# Altium schematic sheet T-FLASH.SchDoc: Air724UG 参考设计
size 594 x 419 mm; DESIGNER: Loukanghua; REV: V1.0
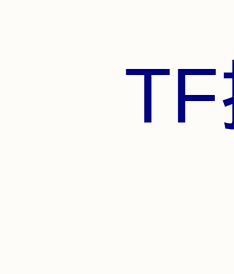
[diagram p0: T-FLASH.SchDoc, top left]
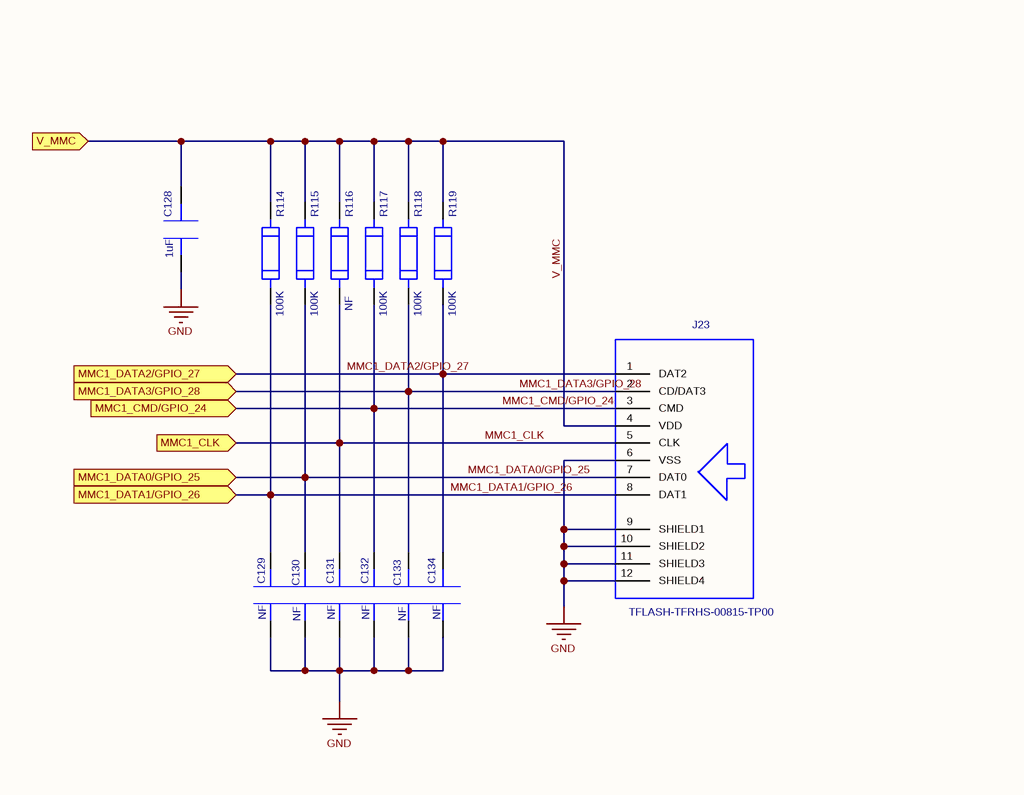
[diagram p1: T-FLASH.SchDoc, top middle]
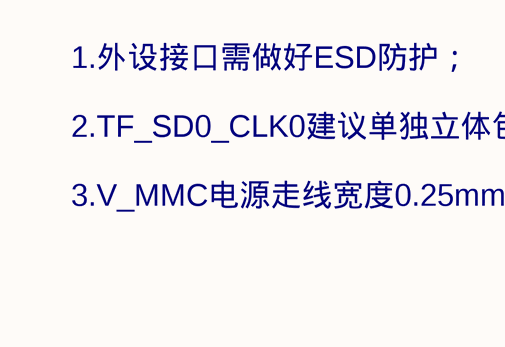
[diagram p2: T-FLASH.SchDoc, bottom middle]
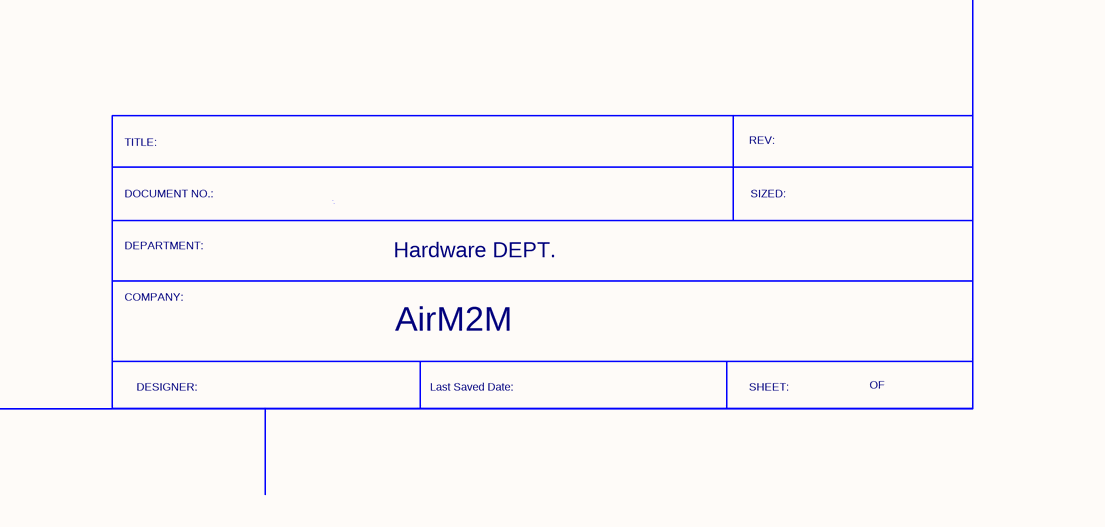
[diagram p3: T-FLASH.SchDoc, bottom right]

## Parts
C128  value 1uF  [SC0402]  (hidden comment: CAP-1UF-0402-X5R)
C129  value NF  [SC0402-NF]  (hidden comment: CAP-0402-NF)
C130  value NF  [SC0402-NF]  (hidden comment: CAP-0402-NF)
C131  value NF  [SC0402-NF]  (hidden comment: CAP-0402-NF)
C132  value NF  [SC0402-NF]  (hidden comment: CAP-0402-NF)
C133  value NF  [SC0402-NF]  (hidden comment: CAP-0402-NF)
C134  value NF  [SC0402-NF]  (hidden comment: CAP-0402-NF)
J23  TFLASH-TFRHS-00815-TP00  [TFLASH-TFRHS-00815-TP00]
R114  value 100K  [SR0402]  (hidden comment: RES-100K-0402)
R115  value 100K  [SR0402]  (hidden comment: RES-100K-0402)
R116  value NF  [SR0402-NF]  (hidden comment: RES-0402-NF)
R117  value 100K  [SR0402]  (hidden comment: RES-100K-0402)
R118  value 100K  [SR0402]  (hidden comment: RES-100K-0402)
R119  value 100K  [SR0402]  (hidden comment: RES-100K-0402)

## Ports
MMC1_CLK, MMC1_CMD/GPIO_24, MMC1_DATA0/GPIO_25, MMC1_DATA1/GPIO_26, MMC1_DATA2/GPIO_27, MMC1_DATA3/GPIO_28, V_MMC

## Nets
GND: C128.2 C129.2 C130.2 C131.2 C132.2 C133.2 C134.2 J23.6(VSS) J23.9(SHIELD1) J23.10(SHIELD2) J23.11(SHIELD3) J23.12(SHIELD4)
MMC1_CLK: C131.1 J23.5(CLK) R116.1 ; port MMC1_CLK
MMC1_CMD/GPIO_24: C132.1 J23.3(CMD) R117.1 ; port MMC1_CMD/GPIO_24
MMC1_DATA0/GPIO_25: C130.1 J23.7(DAT0) R115.1 ; port MMC1_DATA0/GPIO_25
MMC1_DATA1/GPIO_26: C129.1 J23.8(DAT1) R114.1 ; port MMC1_DATA1/GPIO_26
MMC1_DATA2/GPIO_27: C134.1 J23.1(DAT2) R119.1 ; port MMC1_DATA2/GPIO_27
MMC1_DATA3/GPIO_28: C133.1 J23.2(CD/DAT3) R118.1 ; port MMC1_DATA3/GPIO_28
V_MMC: C128.1 J23.4(VDD) R114.2 R115.2 R116.2 R117.2 R118.2 R119.2 ; port V_MMC

## Notes on the sheet
- TF接口参考电路
- 1.外设接口需做好ESD防护；
- 2.TF_SD0_CLK0建议单独立体包地，其他信号线整组一起同层包地；
- 3.V_MMC电源走线宽度0.25mm以上。
- TITLE:
- REV:
- DEPARTMENT:
- DOCUMENT NO.:
- Hardware DEPT.
- SIZED:
- COMPANY:
- AirM2M
- DESIGNER:
- Last Saved Date:
- SHEET:
- OF

## Library data of the parts
C128 = CAP-1UF-0402-X5R: CAP CER X5R;1uF;+/-10%;6.3V;0402;0.5mm;ROHS; Manufacture 1 P/N: GRM155R60J105K****;CC0402KRX5R5BB105;C1005X5R0J105KT;JMK105BJ105KV-F;ECJ0EB0J105K;0402X105K6R3CT;CL05A105KQ5NNNC; Manufacture 1: Murata;Yageo;TDK;Taiyo Yuden;Panasonic;Walsin;Samsung; Serial Number: 80214710001; Geometry.Height: 0.55mm; Tolerance: +/-10%; PCB DECAL: SC0402
C129-C134 = CAP-0402-NF: NF; Geometry.Height: 0.55mm; Manufacture 1: NF; Manufacture 1 P/N: NF; Serial Number: NF; PCB DECAL: SC0402-NF
J23 = TFLASH-TFRHS-00815-TP00: T-FLASH卡座;8PIN;掀盖式;13.6*14.5*1.95mm;ROHS; Manufacture 1 P/N: CAH11-08193-SF01;TFRHS-00815-TP00;TFRHS-00815-XX00;AC0200-020;TF0108322-R;SG-TFS-0001; Manufacture 1: 乾德电子;皇泽;上海徕木;精塑;Singeen(星擎)();; serial number: TF0108522-R; Geometry.Height: 1.95mm; PCB DECAL: TFLASH-TFRHS-00815-TP00
R114 R115 R117-R119 = RES-100K-0402: RES FILM;100K;+/-5%;1/16W;0402;0.4mm;ROHS; Manufacture 1: YAGEO;Walsin; Manufacture 1 P/N: RC0402JR-07100KL;WR04X104_JTL;; Geometry.Height: 0.40mm; Serial Number: 80114640005; Tolerance: +/-5%; PCB DECAL: SR0402
R116 = RES-0402-NF: NF; Geometry.Height: 0.4mm; Tolerance: +/-5%; Serial Number: NF; Manufacture 1: NF; Manufacture 1 P/N: NF; PCB DECAL: SR0402-NF